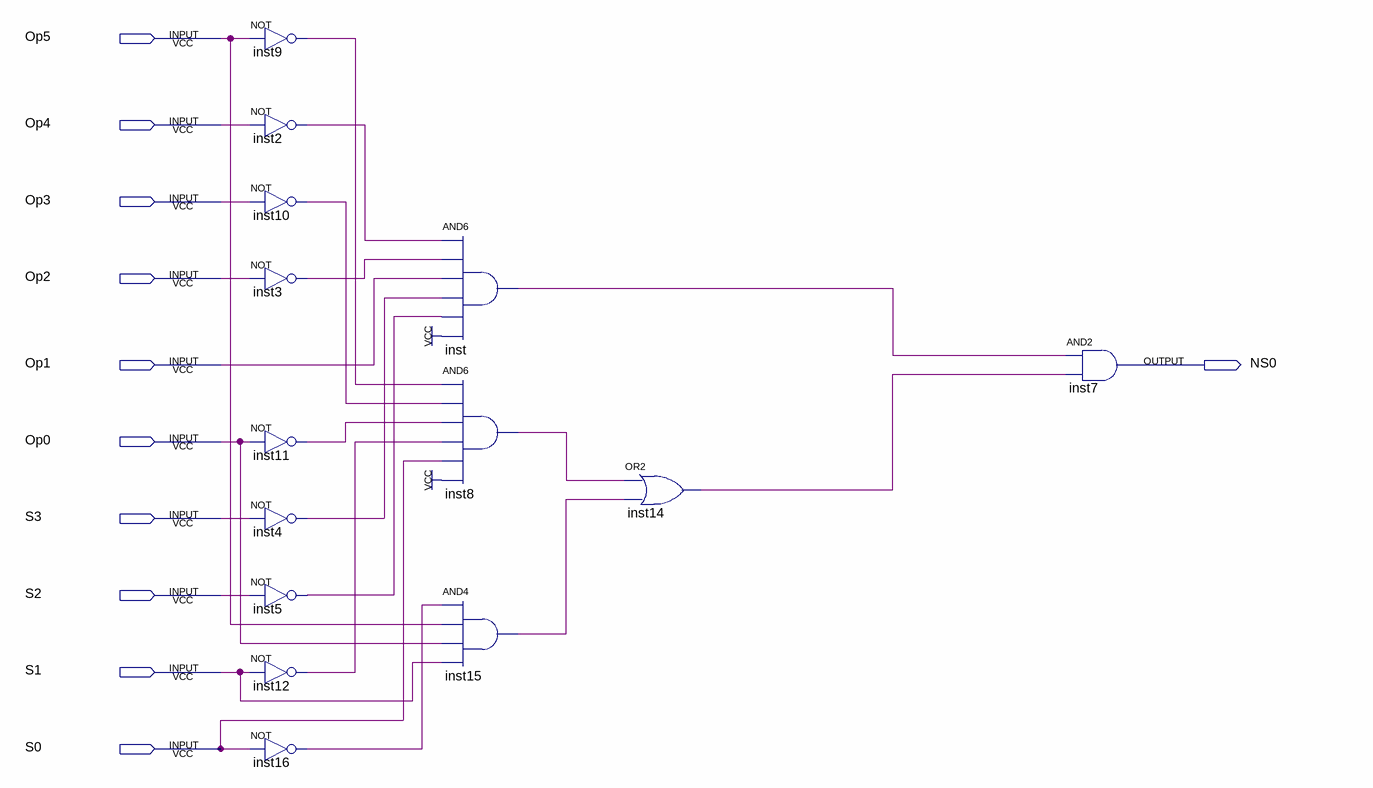
[diagram p0: schematic sheet]
// Quartus schematic NS0.bdf as structural Verilog: 14 symbols, 11 pins
module NS0 (
  input  Op5,
  input  Op4,
  input  Op3,
  input  Op2,
  input  Op1,
  input  Op0,
  input  S3,
  input  S2,
  input  S1,
  input  S0,
  output NS0
);

  wire inst2_out, inst3_out, inst4_out, inst5_out, inst8_out, inst9_out, inst10_out, inst11_out, inst12_out,
       inst14_out, inst15_out, inst16_out, inst_out;

  not inst9 (inst9_out, Op5);
  not inst2 (inst2_out, Op4);
  not inst10 (inst10_out, Op3);
  not inst3 (inst3_out, Op2);
  not inst11 (inst11_out, Op0);
  not inst4 (inst4_out, S3);
  not inst5 (inst5_out, S2);
  not inst12 (inst12_out, S1);
  not inst16 (inst16_out, S0);
  and inst (inst_out, inst2_out, inst3_out, Op1, inst4_out, inst5_out, 1'b1);
  and inst8 (inst8_out, inst9_out, inst10_out, inst11_out, inst12_out, S0, 1'b1);
  and inst15 (inst15_out, inst16_out, Op5, Op0, S1);
  or inst14 (inst14_out, inst8_out, inst15_out);
  and inst7 (NS0, inst_out, inst14_out);
endmodule
